# Altium schematic sheet Power_Supply_CurrentMeasurement.SchDoc
size A4; CompanyName: Technische Hochschule Nürnberg Georg Simon Ohm; Address1: Fürther Straße 250; Address2: 90429 Nürnberg; Address3: GERMANY; SheetNumber: 2; SheetTotal: 5; CompanyName2: Institut ELSYS
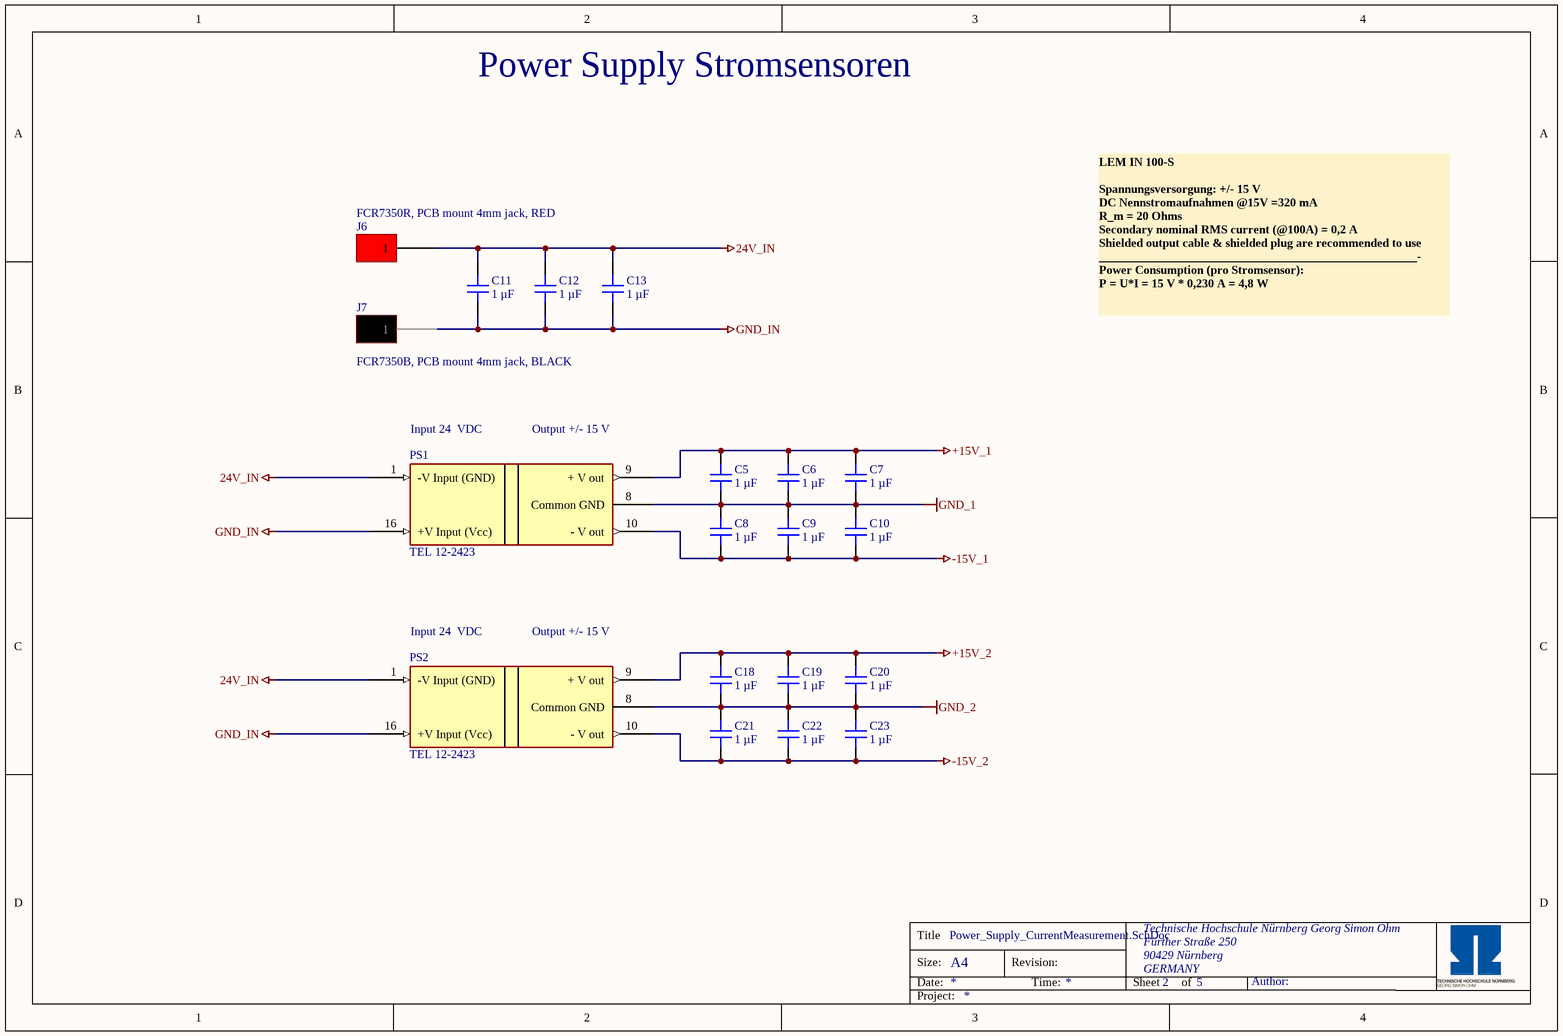
[diagram p0: Power_Supply_CurrentMeasurement.SchDoc]

## Parts
C5  1 µF  [C_0603]
C6  1 µF  [C_0603]
C7  1 µF  [C_0603]
C8  1 µF  [C_0603]
C9  1 µF  [C_0603]
C10  1 µF  [C_0603]
C11  1 µF  [C_0603]
C12  1 µF  [C_0603]
C13  1 µF  [C_0603]
C18  1 µF  [C_0603]
C19  1 µF  [C_0603]
C20  1 µF  [C_0603]
C21  1 µF  [C_0603]
C22  1 µF  [C_0603]
C23  1 µF  [C_0603]
J6  FCR7350R, PCB mount 4mm jack, RED  [FCR7350]
J7  FCR7350B, PCB mount 4mm jack, BLACK  [FCR7350]
PS1  TEL 12-2423  [TEL 12-2423]
PS2  TEL 12-2423  [TEL 12-2423]

## Nets
24V_IN: C11.1 C12.1 C13.1 J6.1 PS1.1(-V_Input_(GND)) PS2.1(-V_Input_(GND))
+15V_1: C5.2 C6.2 C7.2 PS1.9(+_V_out)
+15V_2: C18.2 C19.2 C20.2 PS2.9(+_V_out)
-15V_1: C8.1 C9.1 C10.1 PS1.10(-_V_out)
-15V_2: C21.1 C22.1 C23.1 PS2.10(-_V_out)
GND_1: C5.1 C6.1 C7.1 C8.2 C9.2 C10.2 PS1.8(Common_GND)
GND_2: C18.1 C19.1 C20.1 C21.2 C22.2 C23.2 PS2.8(Common_GND)
GND_IN: C11.2 C12.2 C13.2 J7.1 PS1.16(+V_Input_(Vcc)) PS2.16(+V_Input_(Vcc))

## Notes on the sheet
- Power Supply Stromsensoren
- LEM IN 100-S
  Spannungsversorgung: +/- 15 V
  DC Nennstromaufnahmen @15V =320 mA
  R_m = 20 Ohms
  Secondary nominal RMS current (@100A) = 0,2 A
  Shielded output cable & shielded plug are recommended to use
  _____________________________________________________-
  Power Consumption (pro Stromsensor):
  P = U*I = 15 V * 0,230 A = 4,8 W
- (near PS1) Input 24  VDC
- (near PS1) Output +/- 15 V
- (near PS2) Input 24  VDC
- (near PS2) Output +/- 15 V
- Title
- Size:
- Date:
- A4
- Revision:
- Time:
- Sheet
- of
- Author:
- Project:

## Library data of the parts
C5-C13 C18-C23 = CL10A105KB8NNNC: 50V 1uF X5R ±10% 0603  Multilayer Ceramic Capacitors MLCC - SMD/SMT ROHS; Manufacturer: Samsung Electro-Mechanics; Voltage Rating: 50 VDC; Created from: MGremer; Supplier 1: LCSC; Supplier Part Number 1: C15849; Manufacturer Part Number: CL10A105KB8NNNC; Value: 1 µF; PartID: 5; Created On: 20.12.2020 13:54:13; ComponentLink1Description: Datasheet; ComponentLink1URL: https://datasheet.lcsc.com/lcsc/1810261812_Samsung-Electro-Mechanics-CL10A105KB8NNNC_C15849.pdf; Component Type: Capacitor 0603; Device Package: 0603; Last Updated: 28.11.2022 17:23:01; Mounting Type: SMD; Operating Temperature: -55 - 85°C; Series: M; Type: Capacitor; Tolerance: 10 %; Live Cycle Status: 1; LCSC Part Number: C15849; Stock number: Labor SMD Container
J6 = FCR7350R: FCR7350B, 1000V, 24A, RED; Manufacturer: Cliff; Value: PCB mount 4mm jack, Red FCR7350R, 1000V, 24A; Created from: DHufnagel; Manufacturer Part Number: FCR7350R; PartID: 7; Created On: 13.06.2022 10:18:11; ComponentLink1Description: datasheet; ComponentLink1URL: https://www.cliffuk.co.uk/products/testleads/sockets/S16NPC.pdf; ComponentLink2Description: drawing; ComponentLink2URL: https://media.digikey.com/pdf/Data%20Sheets/Cliff%20Electronic%20LTD%20PDF's/FCR7350_Drawing.pdf; Component Type: PCB mount 4mm jack, Red; Device Package: THT; Last Updated: 28.06.2022 13:58:37; Minimum Order: 1; Mounting Type: THT; Operating Temperature: -40°C - 80°C; Series: S16N-PC; Supplier 1: Digi-Key; Supplier Part Number 1: 3185-FCR7350R-ND; Supplier 2: farnell; Supplier Part Number 2: 1854508; Type: PCB mount 4mm jack, Red FCR7350R, 1000V, 24A; Live Cycle Status: 1; Stock number: not stored
J7 = FCR7350B: FCR7350B, 1000V, 24A, BLACK; Manufacturer: Cliff; Value: PCB mount 4mm jack, Black	FCR7350B, 1000V, 24A; Created from: DHufnagel; Manufacturer Part Number: FCR7350B; PartID: 6; Created On: 13.06.2022 10:18:11; ComponentLink1Description: datasheet; ComponentLink1URL: https://www.cliffuk.co.uk/products/testleads/sockets/S16NPC.pdf; ComponentLink2Description: drawing; ComponentLink2URL: https://media.digikey.com/pdf/Data%20Sheets/Cliff%20Electronic%20LTD%20PDF's/FCR7350_Drawing.pdf; Component Type: PCB mount 4mm jack, Black; Device Package: THT; Last Updated: 28.06.2022 13:58:37; Minimum Order: 1; Mounting Type: THT; Operating Temperature: -40°C - 80°C; Series: S16N-PC; Supplier 1: Digi-Key; Supplier Part Number 1: 3185-FCR7350B-ND; Supplier 2: farnell; Supplier Part Number 2: 1854507; Type: PCB mount 4mm jack, Black	FCR7350B, 1000V, 24A; Live Cycle Status: 1; Stock number: not stored
PS1 PS2 = TEL 12-2423: Isolierte DC/DC-Wandler – Durchsteckmontage 18-36Vin+/-15V 400mA 12W DIP Iso; Parameter 1: *; Supplier 1: Mouser; Supplier Part Number 1: 490-PGNM1-S24-S5-S